# Altium project PCB_Project_1.PrjPcb
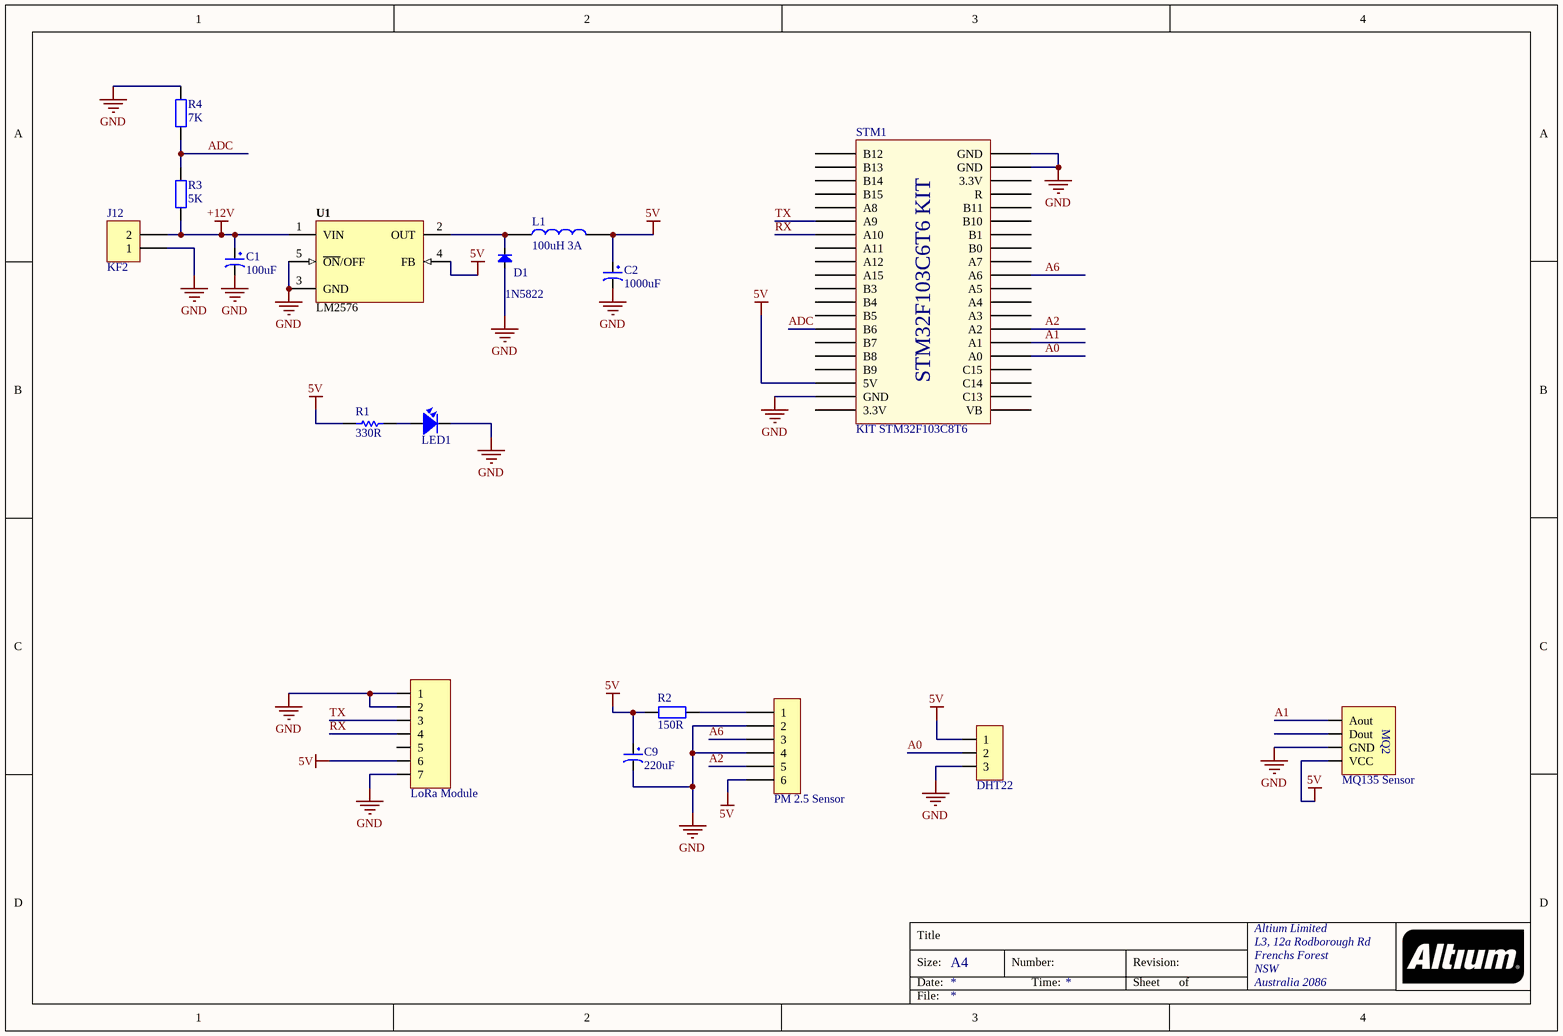
[diagram p0: Tunng_Sheet2.SchDoc]
1 sheet, 17 parts. Net scope: global (net labels, ports and power ports of the same name join across sheets).
Board file: Tunng_PCB2.PcbDoc

## Sheet Tunng_Sheet2.SchDoc
size A4; Organization: Altium Limited; Address1: L3, 12a Rodborough Rd; Address2: Frenchs Forest; Address3: NSW; Address4: Australia 2086

### Parts
C1  100uF  [tu hoa 5mm]
C2  1000uF  [tu hoa 8mm]
C9  220uF  [Tu hoa 8mm]
D1  1N5822  [DIO-3A]
DHT22  DHT22  [JP 1x3 CT]
H2  PM 2.5 Sensor  [XH2.54M-6]
J12  KF2  [KF2-3.5]
L1  100uH 3A  [CUON CAM 100uH3A]
LED1  LED  [LED-3]  (value not drawn)
LoRa_Module  LoRa Module  [JP 1x7 CT]
MQ135_Sensor  MQ135 Sensor  [MQ2-MODULE]
R1  value 330R  [R1/4W]  (hidden comment: Res1)
R2  150R  [tro vach 1/4w]
R3  5K  [tro vach 1/4w]
R4  7K  [tro vach 1/4w]
STM1  KIT STM32F103C8T6  [STM32F103 KIT]
U1  LM2576  [DIP5]

### Nets
5V: C2.1 C9.1 DHT22.1 H2.6 L1.2 LoRa_Module.6 MQ135_Sensor.4(VCC) R1.1 R2.1 STM1.18(5V) U1.4(FB)
+12V: C1.1 J12.2 R3.2 U1.1(VIN)
GND: C1.2 C2.2 C9.2 D1.1(A) DHT22.3 H2.2 H2.4 J12.1 LED1.2 LoRa_Module.1 LoRa_Module.2 LoRa_Module.7 MQ135_Sensor.3(GND) R4.1 STM1.19(GND) STM1.39(GND) STM1.40(GND) U1.3(GND) U1.5(~{ON}/OFF)
A0: DHT22.2 STM1.25(A0)
A1: MQ135_Sensor.1(Aout) STM1.26(A1)
A2: H2.5 STM1.27(A2)
A6: H2.3 STM1.31(A6)
ADC: R3.1 R4.2 STM1.14(B6)
RX: LoRa_Module.4 STM1.7(A10)
TX: LoRa_Module.3 STM1.6(A9)
NetD1_2: D1.2(K) L1.1 U1.2(OUT)
NetH2_1: H2.1 R2.2
NetLED1_1: LED1.1 R1.2

Not connected (* = marked no-connect by the designer): LoRa_Module 5; MQ135_Sensor 2(Dout); STM1 1(B12) 2(B13) 3(B14) 4(B15) 5(A8) 8(A11) 9(A12) 10(A15) 11(B3) 12(B4) 13(B5) 15(B7) 16(B8) 17(B9) 20(3.3V) 21(VB) 22(C13) 23(C14) 24(C15) 28(A3) 29(A4) 30(A5) 32(A7) 33(B0) 34(B1) 35(B10) 36(B11) 37(R) 38(3.3V)

### Notes on the sheet
- Title
- Size:
- Date:
- A4
- Number:
- Time:
- Revision:
- Sheet
- of
- File:
- (in symbol MQ2-MOD) MQ2
- (in symbol STM32f103 Bluepill) STM32F103C6T6 KIT

### Library data of the parts
C1 = Tu Hoa 100uF 25V 6x11: Cắm; Don_Vi: Con; So_Chan: 2; Ten_Linh_Kien: Tụ Hóa 100uF 25V 6x11MM; Ma_Hang: MH001351; Chung_Loai: Cắm; Kieu_Chan: *
C2 = Tu Hoa 1000uF 16V 8x20: Cắm; Don_Vi: Con; So_Chan: 2; Ten_Linh_Kien: Tụ Hóa 1000uF 16V 8x20MM; Ma_Hang: MH008300; Chung_Loai: Cắm; Kieu_Chan: *
C9 = Tu Hoa 220uF 25V 8x10: Cắm; Don_Vi: Con; So_Chan: 2; Ten_Linh_Kien: Tụ Hóa 220uF 25V 8x10MM; Ma_Hang: MH006864; Chung_Loai: Cắm; Kieu_Chan: *
D1 = Diode: Default Diode; Code - JEDEC: DO-214-AB; Value: 1N5007; Published: 8-Jun-2000; Revision: July-2002: Re-released for DXP Platform.; Publisher: Altium Limited
DHT22 = JP 1x3 2.54 Cai Thang: Cắm; Ten_Linh_Kien: Jump Đơn Cái 2.54MM 1x20P Thẳng; Don_Vi: Con; Ma_Hang: MH004006; Ghi_Chu: *; Kieu_Chan: *; Chung_Loai: Cắm
H2 = Header 6P 2.54 Duc Thang: Cắm; Ten_Linh_Kien: Header 6P XH2.54-6P Đực Thẳng; Don_Vi: Con; Ma_Hang: MH001972; Chung_Loai: Cắm
J12 = KF2: Manufacturer: Würth Elektronik eiSos GmbH; partNo: 691103110002; ComponentLink1 Description: Manufacturer; ComponentLink2 Description: Datasheet; NoPins: 2; Created Date: 29 October 2013; ComponentLink1URL: http://www.we-online.com; ComponentLink2URL: http://katalog.we-online.de/em/datasheet/6911031100xx.pdf; Created by: Karrer Zheng
L1 = CUON CAM 100uH DIP: Dán; Don_Vi: Con; Ma_Hang: MH002209; Ten_Linh_Kien: Cuộn Cảm 100uH 3A 8x10MM; Chung_Loai: Dán; Ghi Chu: *; Kieu Chan: *
LED1 = LED: LED Single colour Green and Red; Value: LED 3 ly Single Colour
LoRa_Module = JP 1x7 2.54 Cai Thang: Cắm; Ten_Linh_Kien: Jump Đơn Cái 2.54MM 1x20P Thẳng; Don_Vi: Con; Ma_Hang: MH004006; Ghi_Chu: *; Kieu_Chan: *; Chung_Loai: Cắm
MQ135_Sensor = MQ2-MOD: Manufacturer: W¨¹rth Elektronik eiSos GmbH; partNo: 613004143121; ComponentLink1 Description: Manufacturer; ComponentLink2 Description: Datasheet; NoPins: 04; Created Date: 29 March 2013; ComponentLink1URL: http://www.we-online.com; ComponentLink2URL: http://katalog.we-online.de/em/datasheet/6130xx143121.pdf; Created by: Karrer Zheng
R1 = Res1_1: Resistor; Manufacturer: Generic Components; Class: Passive; Published: 08/06/2000; Publisher: Altium Hobart Technology Centre; SubClass: Resistor
R2-R4 = Tro Vach 1/4W 5% 510R: Cắm; So_Chan: 2; Don_Vi: Con; Ten_Linh_Kien: Trở Vạch 1/4w 5% 510R; Ma_Hang: MH007325; Chung_Loai: Cắm; Kieu_Chan: *
STM1 = STM32f103 Bluepill: KIT STM32F103C8T6 Bluepill
U1 = LM2576: Max Input Voltage: 12 V; Max Output Current: 3 (6.0 peak) A; Max Output Voltage: mV; Category: IC-Power; Min Input Voltage: mV; Min Output Voltage: mV; Mounting Technology: Surface Mount; Status: Unreleased; Supply Voltage: mV; Temperature Range: -40 to +125 degC